# Altium project JLINK_OB_072.PrjPcb
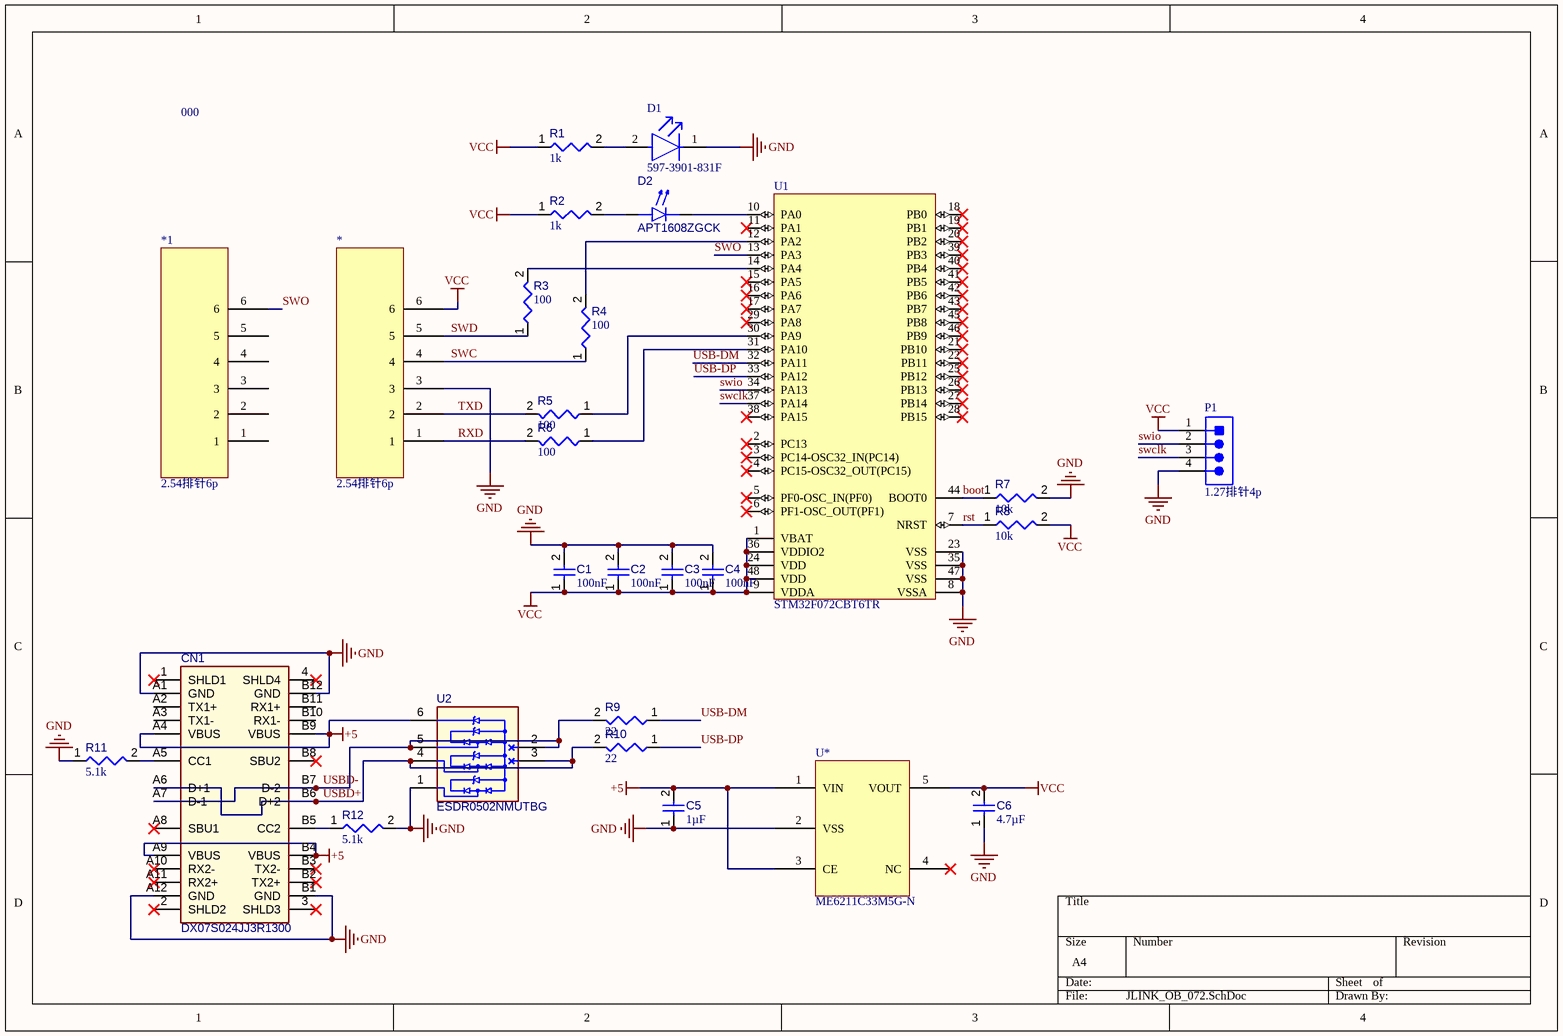
[diagram p0: JLINK_OB_072.SchDoc]
1 sheet, 27 parts. Net scope: global (net labels, ports and power ports of the same name join across sheets).
Board file: JLINK_OB_072.PcbDoc

## Sheet JLINK_OB_072.SchDoc
size A4; SheetNumber: 1; SheetTotal: 1

### Parts
*  2.54排针6p  [HDR2.54-WS-6P]
*1  2.54排针6p  [HDR2.54-WS-6P]
C1  value 100nF  [CAPC1608X90X40NL10T20]  (hidden comment: Capacitor 100 nF +/-10% 50 V 0603)
C2  value 100nF  [CAPC1608X90X40NL10T20]  (hidden comment: Capacitor 100 nF +/-10% 50 V 0603)
C3  value 100nF  [CAPC1608X90X40NL10T20]  (hidden comment: Capacitor 100 nF +/-10% 50 V 0603)
C4  value 100nF  [CAPC1608X90X40NL10T20]  (hidden comment: Capacitor 100 nF +/-10% 50 V 0603)
C5  value 1µF  [CAPC1608X90X40LL10T20]  (hidden comment: Capacitor 1 uF +/- 10% 25 V 0603)
C6  value 4.7µF  [CAPC0603(1608)100_L]  (hidden comment: Capacitor 4.7µF +/-20% 10V 0603)
CN1  DX07S024JJ3R1300  [JAE-DX07S024JJ3_V]
D1  597-3901-831F  [FP-597-3901-831F-MFG]
D2  APT1608ZGCK  [FP-APT1608ZGCK-MFG]
P1  1.27排针4p  [HDR1.27-LI-4P]
R1  value 1k  [RESC1608X55X25ML10T15]  (hidden comment: Resistor 1k +/-1% 0603 100 mW)
R2  value 1k  [RESC1608X55X25ML10T15]  (hidden comment: Resistor 1k +/-1% 0603 100 mW)
R3  value 100  [FP-RC0603-0_55-MFG]  (hidden comment: RC0603JR-07100RL)
R4  value 100  [FP-RC0603-0_55-MFG]  (hidden comment: RC0603JR-07100RL)
R5  value 100  [FP-RC0603-0_55-MFG]  (hidden comment: RC0603JR-07100RL)
R6  value 100  [FP-RC0603-0_55-MFG]  (hidden comment: RC0603JR-07100RL)
R7  value 10k  [RESC1608X55X25ML10T15]  (hidden comment: Resistor 10k +/-1% 0603 100 mW)
R8  value 10k  [RESC1608X55X25ML10T15]  (hidden comment: Resistor 10k +/-1% 0603 100 mW)
R9  value 22  [RESC1609X50X30ML08T20]  (hidden comment: Resistor 22R +/-1% 0603 100 mW)
R10  value 22  [RESC1609X50X30ML08T20]  (hidden comment: Resistor 22R +/-1% 0603 100 mW)
R11  value 5.1k  [FP-RC1608-MFG]  (hidden comment: RC1608J512CS)
R12  value 5.1k  [FP-RC1608-MFG]  (hidden comment: RC1608J512CS)
U1  STM32F072CBT6TR  [LQFP48 7X7_N]
U2  ESDR0502NMUTBG  [ONSC-UDFN-6-517AA-01_V]
U*  ME6211C33M5G-N  [SOT23-5N]

### Nets
+5: C5.2 CN1.A4(VBUS) CN1.A9(VBUS) CN1.B4(VBUS) CN1.B9(VBUS) U2.6(VBUS) U*.1(VIN) U*.3(CE)
GND: *.3 C1.2 C2.2 C3.2 C4.2 C5.1 C6.1 CN1.A1(GND) CN1.A12(GND) CN1.B1(GND) CN1.B12(GND) D1.1(C) P1.4 R7.2 R11.1 R12.2 U1.8(VSSA) U1.23(VSS) U1.35(VSS) U1.47(VSS) U2.1(GND) U*.2(VSS)
VCC: *.6 C1.1 C2.1 C3.1 C4.1 C6.2 P1.1 R1.1 R2.1 R8.2 U1.1(VBAT) U1.9(VDDA) U1.24(VDD) U1.36(VDDIO2) U1.48(VDD) U*.5(VOUT)
boot: R7.1 U1.44(BOOT0)
rst: R8.1 U1.7(NRST)
RXD: *.1 R6.2
SWC: *.4 R4.1
swclk: P1.3 U1.37(PA14)
SWD: *.5 R3.1
swio: P1.2 U1.34(PA13)
SWO: *1.6 U1.13(PA3)
TXD: *.2 R5.2
USB-DM: R9.1 U1.32(PA11)
USB-DP: R10.1 U1.33(PA12)
USBD+: CN1.A6(D+1) CN1.B6(D+2) R10.2 U2.3(NC) U2.4(D-)
USBD-: CN1.A7(D-1) CN1.B7(D-2) R9.2 U2.2(NC) U2.5(D+)
NetCN1_A5: CN1.A5(CC1) R11.2
NetCN1_B5: CN1.B5(CC2) R12.1
NetD1_2: D1.2(A) R1.2
NetD2_1: D2.1(K) U1.10(PA0)
NetD2_2: D2.2(A) R2.2
NetR3_2: R3.2 U1.14(PA4)
NetR4_2: R4.2 U1.12(PA2)
NetR5_1: R5.1 U1.30(PA9)
NetR6_1: R6.1 U1.31(PA10)

Not connected (* = marked no-connect by the designer): *1 1 2 3 4 5; CN1 1(SHLD1)* 2(SHLD2)* 3(SHLD3)* 4(SHLD4)* A2(TX1+) A3(TX1-) A8(SBU1)* A10(RX2-)* A11(RX2+)* B2(TX2+)* B3(TX2-)* B8(SBU2)* B10(RX1-) B11(RX1+); U1 2(PC13)* 3(PC14-OSC32_IN(PC14))* 4(PC15-OSC32_OUT(PC15))* 5(PF0-OSC_IN(PF0))* 6(PF1-OSC_OUT(PF1))* 11(PA1)* 15(PA5)* 16(PA6)* 17(PA7)* 18(PB0)* 19(PB1)* 20(PB2)* 21(PB10)* 22(PB11)* 25(PB12)* 26(PB13)* 27(PB14)* 28(PB15)* 29(PA8)* 38(PA15)* 39(PB3)* 40(PB4)* 41(PB5)* 42(PB6)* 43(PB7)* 45(PB8)* 46(PB9)*; U* 4(NC)*

### Notes on the sheet
- 000

### Library data of the parts
* *1 = CMP-00001-3
C1-C4 = CMP-001-00017-6: Chip Capacitor, 100 nF, +/- 10%, 50 V, 0603 (1608 Metric); Voltage Rating: 50V; Capacitor Type: Ceramic; Tolerance: 10%; Mounting Technology: SM; Max Operating Temperature: 125°C; RoHS Compliant: True; Pins: 2; Case/Package: 0603; Min Operating Temperature: -55°C
C5 = CMP-001-00005-6: Chip Capacitor, 1 uF, +/- 10%, 25 V, 0603 (1608 Metric); Capacitor Type: Ceramic; Voltage Rating: 25V; Pins: 2; Mounting Technology: SM; RoHS Compliant: True; Max Operating Temperature: 125°C; Case/Package: 0603; Min Operating Temperature: -55°C; Tolerance: 10%
C6 = CMP-001-00076-4: Chip Capacitor, 4.7µF +/-20%, 10V, 0603, Thickness 1 mm; Tolerance: 10%; Mounting Technology: SMT; Case/Package: 0603; Pins: 2; Min Operating Temperature: -55°C; Max Operating Temperature: 85°C; Voltage Rating: 10V
CN1 = CMP-002-00065-4: USB-C Connector, 20 V, 1.25 A, -30 to 80 degC, RoHS, Tape and Reel; Gender: Receptacle; Pins: 28; Connector Type: USB-C
D1 = CMP-00000-1: Smd 0603 White 20Pc Smpl Strip / Dialight Corporation Rohs Compliant: Yes; Lens Style: Diffused,Tinted,Rectangular; Lens Color: Yellow; Viewing Angle: 130°; Luminous Intensity: 240mcd; Power Rating: 70mW; Forward Voltage: 3.4V; Test Current: 10mA; Forward Current: 20mA; Package Quantity: 20; Case Code (Imperial): 0603; Max Operating Temperature: 80°C; RoHS Compliant: Yes; Min Operating Temperature: -20°C; Height: 0.55mm; Length: 1.6mm; Case Code (Metric): 1608; Illumination Color: White; Packaging: Cut Tape; Case/Package: 0603; Width: 0.8mm; Reach SVHC Compliant: Yes; Series: 597; Mounting Technology: Surface Mount; Color: White
D2 = CMP-007-00036-1: LED Uni-Color Green 515nm 2-Pin Chip LED T/R; Forward Current: 20mA; Forward Voltage: 3.3V; RoHS Compliant: Yes; Max Operating Temperature: 85°C; Min Operating Temperature: -40°C; Case/Package: 0603; Mounting Technology: Surface Mount
P1 = CMP-002-00077-1
R1 R2 = CMP-009-00014-5: Chip Resistor, 1 KOhm, +/-1%, 0.1 W, -55 to 155 degC, 0603 (1608 Metric); Voltage Rating: 50V; Power: 100mW; Tolerance: 1%; Mounting Technology: SM; Pins: 2; Case/Package: 0603; Min Operating Temperature: -55°C; RoHS Compliant: True; Max Operating Temperature: 155°C
R3-R6 = CMP-009-00182-1: Res Thick Film 0603 100 Ohm 5% 1/10W ±100ppm/°C Molded SMD SMD Paper T/R; Voltage Rating: 50V; Min Operating Temperature: -55°C; RoHS Compliant: Yes; Pins: 2; Tolerance: 5%; Case/Package: 0603; Max Operating Temperature: 155°C
R7 R8 = CMP-009-00017-5: Chip Resistor, 10 KOhm, +/- 1%, 01 W, -55 to 155 degC, 0603 (1608 Metric); Voltage Rating: 50V; Power: 100mW; RoHS Compliant: True; Min Operating Temperature: -55°C; Pins: 2; Case/Package: 0603; Mounting Technology: SM; Max Operating Temperature: 155°C; Tolerance: 1%
R9 R10 = CMP-009-00027-5: Chip Resistor, 22 Ohm, +/- 1%, 100 mW, -55 to 155 degC, 0603 (1608 Metric); Power: 100mW; Voltage Rating: 75V; Max Operating Temperature: 155°C; Min Operating Temperature: -55°C; Tolerance: 1%; RoHS Compliant: True; Mounting Technology: SM; Case/Package: 0603; Pins: 2
R11 R12 = CMP-009-00183-1: Res Thick Film 0603 5.1K Ohm 5% 1/10W ±100ppm/°C Molded SMD SMD T/R; Max Operating Temperature: 155°C; Tolerance: 5%; Case/Package: 0603; RoHS Compliant: Yes; Min Operating Temperature: -55°C
U1 = CMP-020-00024-2: MCU 32-Bit GP STM32F 32MHz ARM Cortex M0+ RISC 128kB Flash 48-Pin LQFP T/R; RAM Size: 16KB; Min Supply Voltage: 2V; Clock Frequency: 48MHz; Max Supply Voltage: 3.6V; Interface: I2C,SPI,USB,CAN,HDMI,IrDA,UART,USART,LIN,I2S; Max Operating Temperature: 85°C; Mounting Technology: Surface Mount; RoHS Compliant: Yes; Case/Package: LQFP; Pins: 48; Frequency: 48MHz; Min Operating Temperature: -40°C
U2 = CMP-004-00025-1: Ultra Low Capacitance ESD Protection Array for High Speed Data Line Protection, 6-Pin UDFN, Pb-Free, Tape and Reel; ComponentLink2Description: Datasheet; ComponentLink3URL: http://www.onsemi.com/pub_link/Collateral/517AA.PDF; Mounting Technology: SMT; ComponentLink1URL: http://www.onsemi.com/; Pins: 6; ComponentLink3Description: Package Specification; ComponentLink1Description: Manufacturer URL; ComponentLink2URL: http://www.onsemi.cn/pub_link/Collateral/ESDR0502N-D.PDF
U* = CMP-019-00052-1: VIN=6.5V Vo=3.3V Io=600mA